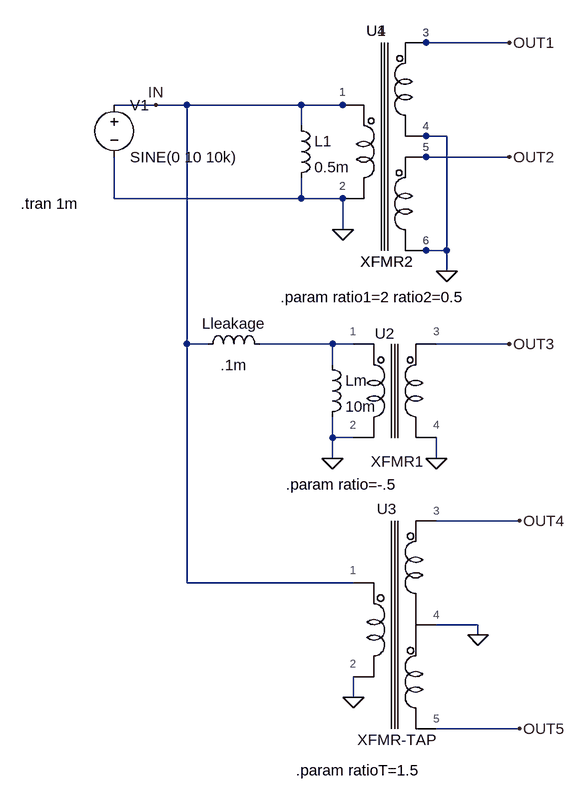
[diagram p0: schematic xfmr.asc]
xfmr.asc, the LTspice schematic file:
Version 4
SHEET 1 880 1152
WIRE 400 16 272 16
WIRE -144 112 -208 112
WIRE -96 112 -144 112
WIRE 80 112 -96 112
WIRE 144 112 80 112
WIRE 80 144 80 112
WIRE 304 160 272 160
WIRE 400 192 272 192
WIRE -208 256 -208 192
WIRE 80 256 80 224
WIRE 80 256 -208 256
WIRE 144 256 80 256
WIRE 144 304 144 256
WIRE 304 336 304 160
WIRE 304 336 272 336
WIRE 304 368 304 336
WIRE -96 480 -96 112
WIRE -64 480 -96 480
WIRE 128 480 16 480
WIRE 160 480 128 480
WIRE 400 480 288 480
WIRE 128 512 128 480
WIRE 128 624 128 592
WIRE 160 624 128 624
WIRE 128 656 128 624
WIRE 288 656 288 624
WIRE 416 752 288 752
WIRE -96 848 -96 480
WIRE 160 848 -96 848
WIRE 352 912 288 912
WIRE 352 928 352 912
WIRE 160 1024 160 992
WIRE 416 1072 288 1072
FLAG 144 304 0
FLAG 304 368 0
FLAG -144 112 IN
FLAG 400 16 OUT1
FLAG 400 192 OUT2
FLAG 128 656 0
FLAG 288 656 0
FLAG 400 480 OUT3
FLAG 416 752 OUT4
FLAG 416 1072 OUT5
FLAG 160 1024 0
FLAG 352 928 0
SYMBOL ind 64 128 R0
SYMATTR InstName L1
SYMATTR Value 0.5m
SYMBOL Misc\\XFMR2 160 176 R0
SYMATTR InstName U1
SYMBOL Misc\\XFMR-TAP 176 912 R0
SYMATTR InstName U3
SYMATTR Description Ideal Transformer
SYMBOL ind -80 496 R270
WINDOW 0 32 56 VTop 0
WINDOW 3 -1 56 VBottom 0
SYMATTR InstName Lleakage
SYMATTR Value .1m
SYMBOL ind 112 496 R0
SYMATTR InstName Lm
SYMATTR Value 10m
SYMBOL voltage -208 96 R0
WINDOW 123 0 0 Left 0
WINDOW 39 0 0 Left 0
SYMATTR InstName V1
SYMATTR Value SINE(0 10 10k)
SYMBOL Misc\\XFMR1 176 640 R0
SYMATTR InstName U2
SYMBOL Misc\\XFMR2 160 176 R0
SYMATTR InstName U4
TEXT -352 264 Left 0 !.tran 1m
TEXT 48 408 Left 0 !.param ratio1=2 ratio2=0.5
TEXT 56 696 Left 0 !.param ratio=-.5
TEXT 72 1136 Left 0 !.param ratioT=1.5

The netlist it stands for:
* xfmr.asc
L1 IN 0 0.5m
XU1 IN 0 OUT1 0 OUT2 0 XFMR2  ; pins 1 2 3 4 5 6
XU3 IN 0 OUT4 0 OUT5 XFMR-TAP  ; pins 1 2 3 4 5
Lleakage IN N001 .1m
Lm N001 0 10m
V1 IN 0 SINE(0 10 10k)
XU2 N001 0 OUT3 0 XFMR1  ; pins 1 2 3 4
XU4 IN 0 OUT1 0 OUT2 0 XFMR2  ; pins 1 2 3 4 5 6
.tran 1m
.param ratio1=2 ratio2=0.5
.param ratio=-.5
.param ratioT=1.5
.lib ..\sym\misc\XFMR.LIB
.backanno
.end